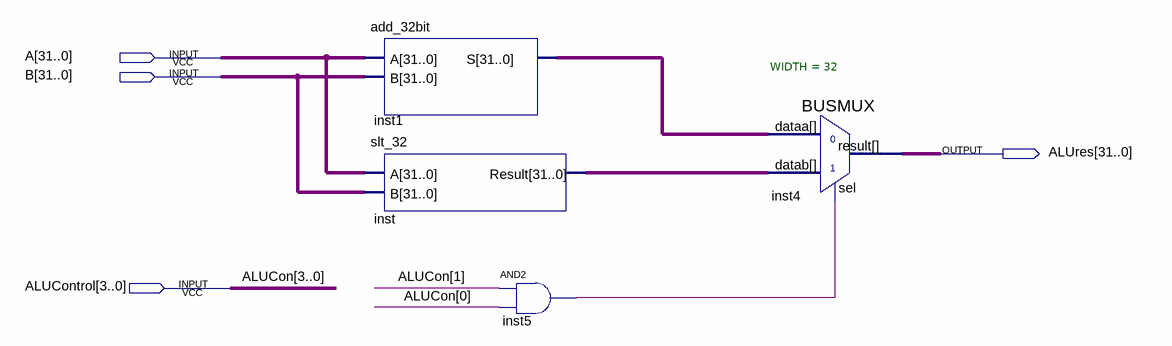
[diagram p0: schematic sheet]
// Quartus schematic ALU.bdf as structural Verilog: 4 symbols, 4 pins
module ALU (
  input  [31:0] A,
  input  [31:0] B,
  input  [3:0] ALUControl,
  output [31:0] ALUres
);

  wire inst5_out;
  wire [31:0] inst1_s, inst_result;

  add_32bit inst1 (.A(A), .B(B), .S(inst1_s));
  slt_32 inst (.A(A), .B(B), .Result(inst_result));
  and inst5 (inst5_out, ALUControl[1], ALUControl[0]);
  BUSMUX #(.WIDTH(32)) inst4 (.datab(inst_result), .sel(inst5_out), .dataa(inst1_s), .result(ALUres));

  // Other names for the same wires on the sheet: ALUCon[3:0] = ALUControl
endmodule
